# Altium schematic sheet Sheet2.SchDoc
size A3; SheetNumber: 1; SheetTotal: 4
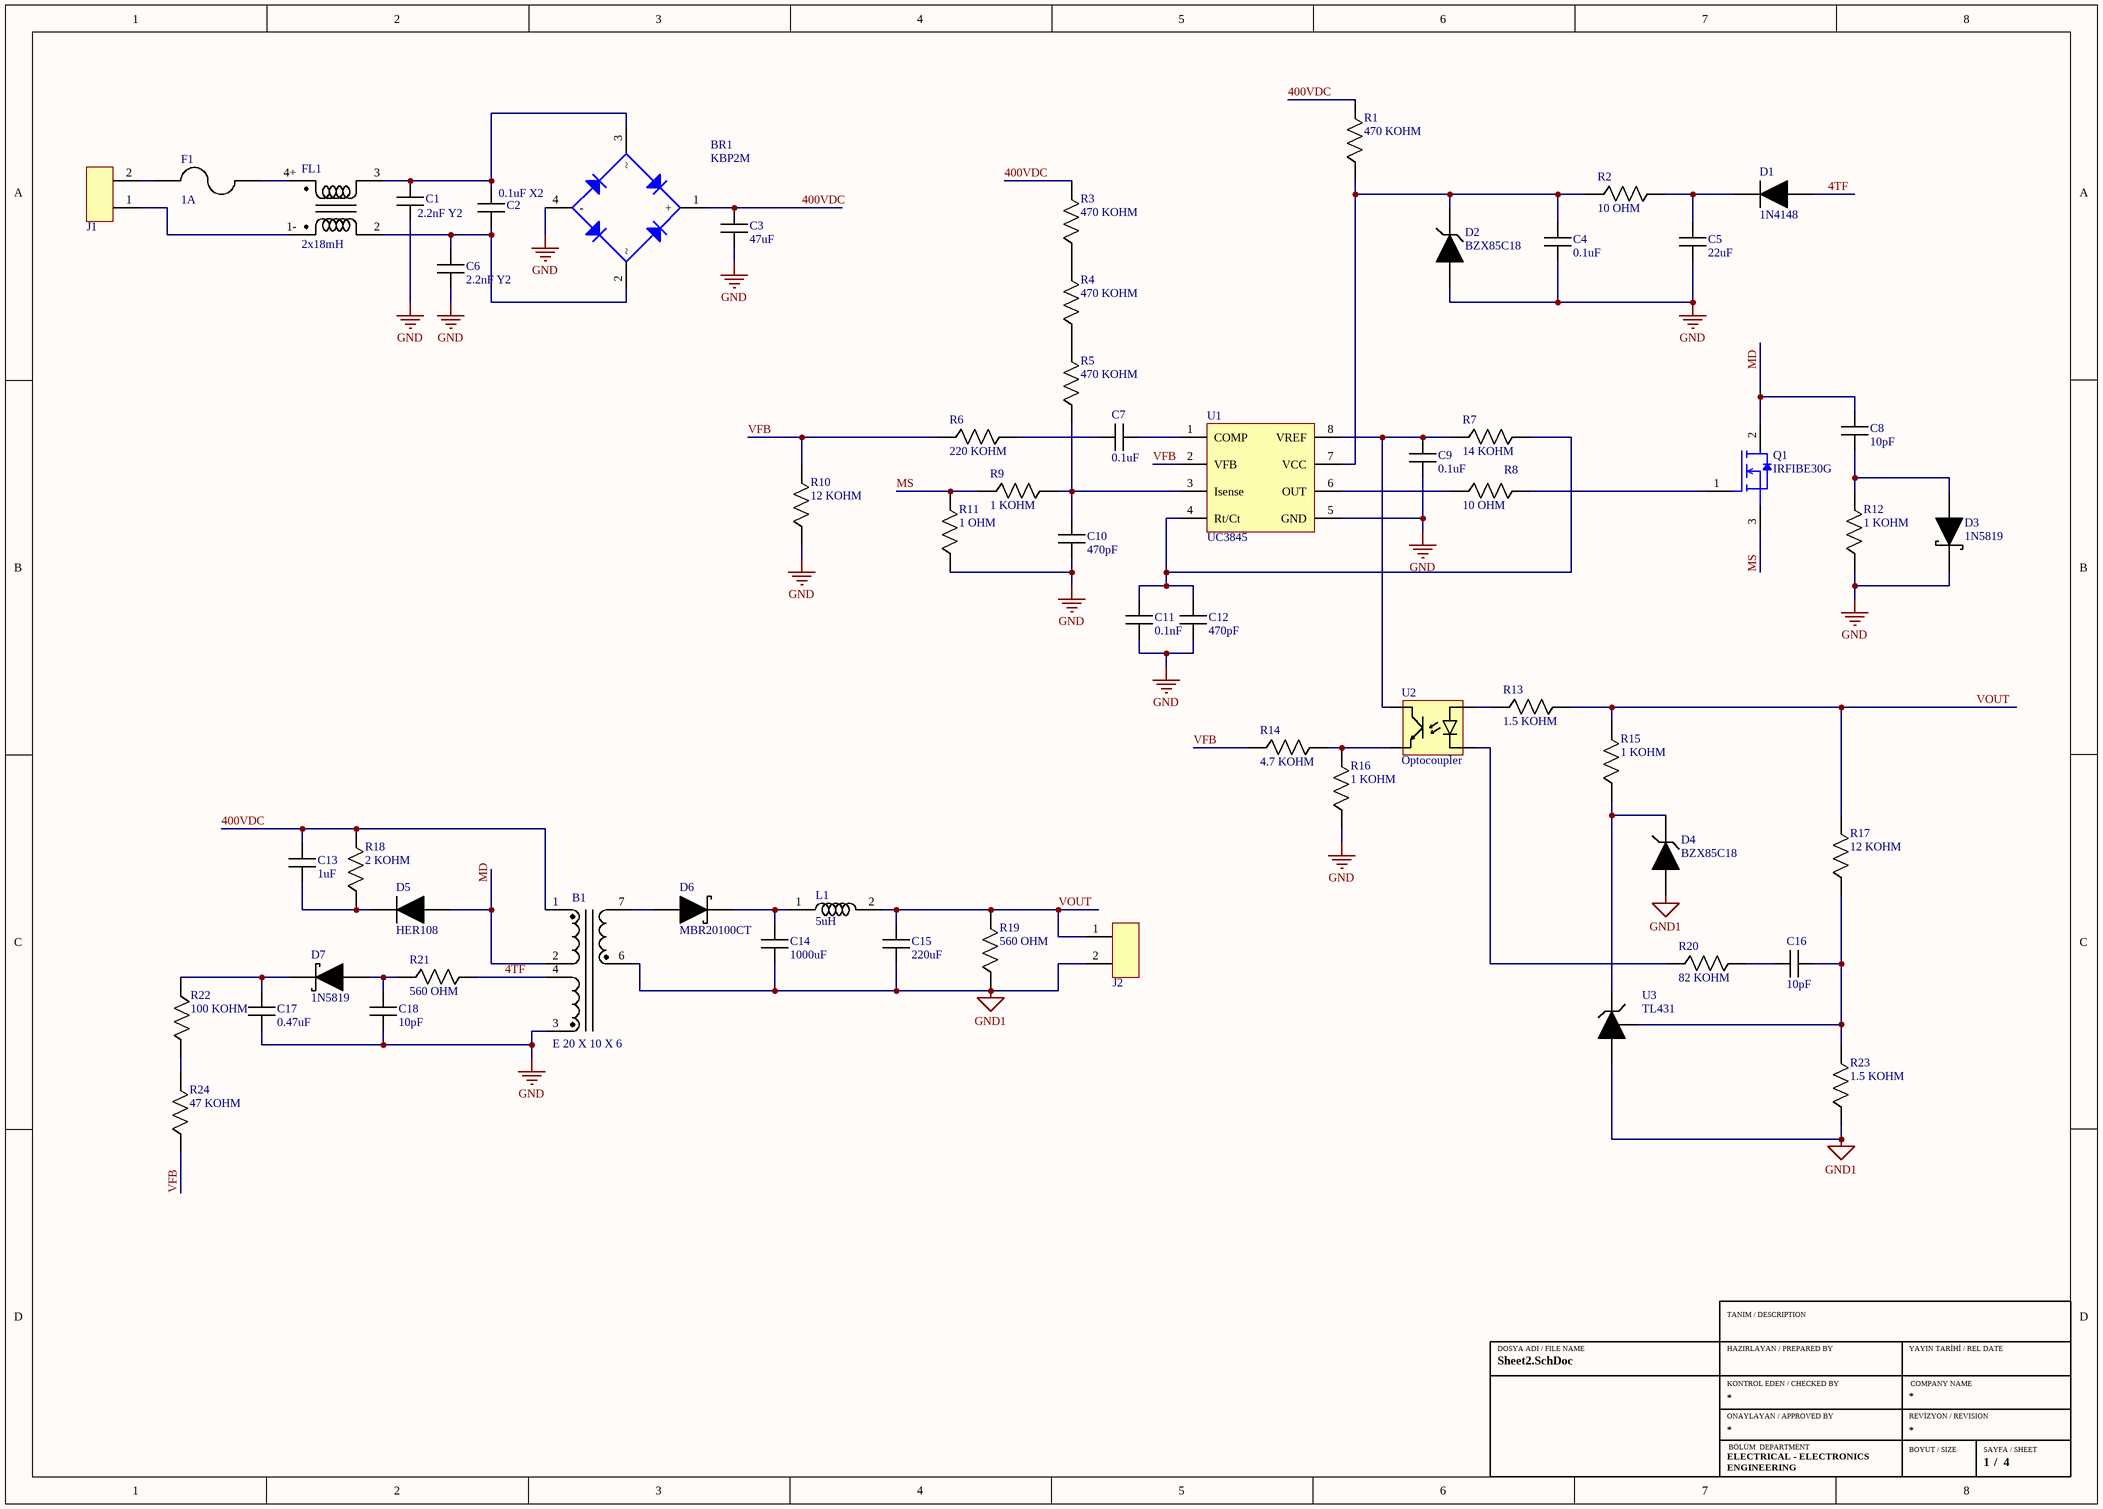
[diagram p0: Sheet2.SchDoc]

## Parts
B1  E 20 X 10 X 6  [BOBBIN]
BR1  KBP2M  [KBP2M]
C1  2.2nF Y2  [Y2-RADIAL]
C2  0.1uF X2  [X2-Radial]
C3  47uF  [CAP ALU 47UF,400VDC]
C4  0.1uF  [CAP CER 100nF]
C5  22uF  [CAP ALU 22uF]
C6  2.2nF Y2  [Y2-RADIAL]
C7  0.1uF  [CAP CER 100nF]
C8  10pF  [CAP ALU 1uF]
C9  0.1uF  [CAP CER 100nF]
C10  470pF  [CAP ALU 1uF]
C11  0.1nF  [CAP CER 100nF]
C12  470pF  [CAP ALU 1uF]
C13  1uF  [CAP ALU 1uF]
C14  1000uF  [CAP ALU 1000uF/16V]
C15  220uF  [CAP ALU 220uF/16v]
C16  10pF  [CAP ALU 1uF]
C17  0.47uF  [CAP ALU 1uF]
C18  10pF  [CAP ALU 1uF]
D1  1N4148  [DO-35]
D2  BZX85C18  [Do-41]
D3  1N5819  [Do-41]
D4  BZX85C18  [Do-41]
D5  HER108  [Do-41]
D6  MBR20100CT  [TO-220]
D7  1N5819  [Do-41]
F1  1A  [fUSE]
FL1  2x18mH  [2x18mH]
J1  HEADER x2  [HEADER X2]  (value not drawn)
J2  HEADER x2  [HEADER X2]  (value not drawn)
L1  5uH  [IND-RADIAL]
Q1  IRFIBE30G  [TO-220]
R1  470 KOHM  [RES]
R2  10 OHM  [RES]
R3  470 KOHM  [RES]
R4  470 KOHM  [RES]
R5  470 KOHM  [RES]
R6  220 KOHM  [RES]
R7  14 KOHM  [RES]
R8  10 OHM  [RES]
R9  1 KOHM  [RES]
R10  12 KOHM  [RES]
R11  1 OHM  [RES]
R12  1 KOHM  [RES]
R13  1.5 KOHM  [RES]
R14  4.7 KOHM  [RES]
R15  1 KOHM  [RES]
R16  1 KOHM  [RES]
R17  12 KOHM  [RES]
R18  2 KOHM  [RES]
R19  560 OHM  [RES]
R20  82 KOHM  [RES]
R21  560 OHM  [RES]
R22  100 KOHM  [RES]
R23  1.5 KOHM  [RES]
R24  47 KOHM  [RES]
U1  UC3845  [8-DIP]
U2  Optocoupler  [4-DIP]
U3  TL431  [TL431 - th - TO92-3]

## Nets
GND: B1.3 BR1.4(-) C1.1 C3.1(-) C4.1(+) C5.1(+) C6.1 C9.1(+) C10.1(+) C11.2(-) C12.2(-) C17.1(+) C18.1(+) D2.A D3.C R10.1 R11.1 R12.1 R16.1 U1.5(GND)
GND1: B1.6 C14.1(+) C15.1(+) D4.A J2.2 R19.1 R23.1 U3.A
4TF: B1.4 D1.A R21.2
400VDC: B1.1 BR1.1(+) C3.2(+) C13.2(-) R1.2 R3.2 R18.2
MD: B1.2 C8.2(-) D5.A Q1.2(D)
MS: Q1.3(S) R9.1 R11.2
VFB: R6.1 R10.2 R14.1 R24.1 U1.2(VFB)
VOUT: C15.2(-) J2.1 L1.2 R13.2 R15.2 R17.2 R19.2
NetB1_7: B1.7 D6.1
NetBR1_2: BR1.2 C2.1 C6.2 FL1.2
NetBR1_3: BR1.3 C1.2 C2.2 FL1.3
NetC4_2: C4.2(-) D2.C R1.1 R2.1 U1.7(VCC)
NetC5_2: C5.2(-) D1.C R2.2
NetC7_1: C7.1(+) R6.2
NetC7_2: C7.2(-) U1.1(COMP)
NetC8_1: C8.1(+) D3.A R12.2
NetC9_2: C9.2(-) R7.1 U1.8(VREF) U2.4
NetC10_2: C10.2(-) R5.1 R9.2 U1.3(Isense)
NetC11_1: C11.1(+) C12.1(+) R7.2 U1.4(Rt/Ct)
NetC13_1: C13.1(+) D5.C R18.1
NetC14_2: C14.2(-) D6.2 L1.1
NetC16_1: C16.1(+) R20.2
NetC16_2: C16.2(-) R17.1 R23.2 U3.R
NetC17_2: C17.2(-) D7.C R22.1
NetC18_2: C18.2(-) D7.A R21.1
NetD4_C: D4.C R15.1 U3.C
NetF1_1: F1.1 J1.2
NetF1_2: F1.2 FL1.4+
NetFL1_1-: FL1.1- J1.1
NetQ1_1: Q1.1(G) R8.2
NetR3_1: R3.1 R4.2
NetR4_1: R4.1 R5.2
NetR8_1: R8.1 U1.6(OUT)
NetR13_1: R13.1 U2.1
NetR14_2: R14.2 R16.2 U2.3
NetR20_1: R20.1 U2.2
NetR22_2: R22.2 R24.2

## Notes on the sheet
- TANIM / DESCRIPTION
- DOSYA ADI / FILE NAME
- HAZIRLAYAN / PREPARED BY
- KONTROL EDEN / CHECKED BY
- YAYIN TARİHİ / REL DATE
- COMPANY NAME
- ONAYLAYAN / APPROVED BY
- ELECTRICAL - ELECTRONICS
- BÖLÜM  DEPARTMENT
- BOYUT / SIZE
- REVİZYON / REVISION
- SAYFA / SHEET
- ENGINEERING
- /

## Library data of the parts
B1 = Transformer: Ferrite Cores & Accessories E20/10/6 N27LP 0.250 MM / B66311G0000X127; Manufacturer: TDK EPCOS; Manufacturer Part Number: B66208-B1110-T1; Supplier 1: Digikey; RoHS: Yes; Stock 1: 6682; Pricing 1: 1=1,27, 10=1,14, 25=0,844, 50=0,802, 100=0,7176, 450=0,63316, 1350=0,58625 (USD); ComponentLink1URL: https://datasheet.ciiva.com/12393/e-25-13-7-525655-12393262.pdf?src-supplier=Mouser; ComponentLink1Description: https://datasheet.ciiva.com/12393/e-25-13-7-525655-12393262.pdf?src-supplier=Mouser; ComponentLink2URL: https://datasheet.ciiva.com/1375/1469926-1375211.pdf?src-supplier=Element14; ComponentLink2Description: https://datasheet.ciiva.com/1375/1469926-1375211.pdf?src-supplier=Element14; Supplier Part Number 1: 495-5372-ND; Supplier 2: Farnell; Category: Uncategorized; Stock 2: 3572; Pricing 2: 1=0,384, 50=0,329, 100=0,274, 250=0,247, 500=0,22, 1470=0,216, 7350=0,215, 14700=0,214 (EUR); ComponentLink3URL: https://datasheet.ciiva.com/22735/1465575-22735656.pdf?src-supplier=Element14; ComponentLink3Description: https://datasheet.ciiva.com/22735/1465575-22735656.pdf?src-supplier=Element14; ComponentLink4URL: https://datasheet.ciiva.com/15162/getdatasheetpartid-476737-15162694.pdf?src-supplier=Verical; ComponentLink4Description: https://datasheet.ciiva.com/15162/getdatasheetpartid-476737-15162694.pdf?src-supplier=Verical; Supplier Part Number 2: 2355087
BR1 = KBP2MI_T0_00101: Bridge Rectifier Single Phase Standard 1 kV Through Hole KBP; Manufacturer: Pan Jit; Supplier 1: DigiKey; Manufacturer Part Number: KBP2MI_T0_00101; RoHS: No; Stock 1: 2737; Pricing 1: 1=0,47, 35=0,37857, 105=0,28124, 525=0,21958, 1015=0,17848, 2030=0,15955, 5005=0,15144, 10010=0,14062, 50015=0,13388 (USD); Supplier Part Number 1: 3757-KBP2MI_T0_00101-ND
C1 C6 = CAP FILM Y2 2200pF/400VAC: CAP FILM 2.2nF 10% 400VAC RADIAL
C2 = Film Cap X2 0.1uF/310VAC: 0.1 µF Film Capacitor 310V Polypropylene (PP), Metallized Radial
C3 = CAP ALU 47uF/400VDC
C4 = CAP CER 0.1uF
C5 = CAP ALU 22uF
C7 C9 = CAP CER 100nF: Cap Ceramic 0.1uF 50V Z5U 20% Radial 5.08mm 85C T/R; Manufacturer: KEMET; Manufacturer Part Number: C322C104M5U5TA7301; Supplier 1: Digikey; RoHS: Yes; Category: Ceramic Capacitors; Stock 1: 1; Pricing 1: 1=0,26, 10=0,166, 50=0,1046, 100=0,0836, 500=0,0604, 1000=0,05343 (USD); ComponentLink1URL: https://datasheet.ciiva.com/39123/f3101-goldmax-39123006.pdf?src-supplier=Onlinecomponents.com; ComponentLink1Description: https://datasheet.ciiva.com/39123/f3101-goldmax-39123006.pdf?src-supplier=Onlinecomponents.com; ComponentLink2URL: https://datasheet.ciiva.com/32430/c052-62-mlcc-series-eng-tds-32430969.pdf?src-supplier=Distrelec; ComponentLink2Description: https://datasheet.ciiva.com/32430/c052-62-mlcc-series-eng-tds-32430969.pdf?src-supplier=Distrelec; ComponentLink3URL: https://datasheet.ciiva.com/6280/f3101-goldmax-6280389.pdf?src-supplier=Digikey; ComponentLink3Description: https://datasheet.ciiva.com/6280/f3101-goldmax-6280389.pdf?src-supplier=Digikey; ComponentLink4URL: https://datasheet.ciiva.com/6280/f3101-goldmax-6280390.pdf?src-supplier=Digikey; ComponentLink4Description: https://datasheet.ciiva.com/6280/f3101-goldmax-6280390.pdf?src-supplier=Digikey; Supplier Part Number 1: 399-9880-1-ND
C8 C16 C18 = CAP CER 10pF
C10 C12 = CAP CER 470pF
C11 = CAP CER 0.1nF
C13 = CAP ALU 1uF/50V: CAP ALUM 1UF 20% 50V RADIAL WCAP-ATG5 Aluminum Electrolytic Capacitors; Manufacturer: Wurth Electronics; Manufacturer Part Number: 860020672005; ESR (Equivalent Series Resistance): 39.553R; Leakage Current: 3uA; Hole Diameter: 800um; Pitch: 2mm; Supplier 1: Digikey; RoHS: Yes; Category: Aluminum Electrolytic Capacitors; Stock 1: 34223; Pricing 1: 1=0,1, 50=0,089, 100=0,078, 250=0,069, 500=0,06, 1000=0,058 (USD); Length: 11mm; ComponentLink1URL: http://www.farnell.com/datasheets/1879647.pdf?src-supplier=Farnell; ComponentLink1Description: http://www.farnell.com/datasheets/1879647.pdf?src-supplier=Farnell; ComponentLink2URL: http://www.farnell.com/datasheets/1879647.pdf?src-supplier=Element14; ComponentLink2Description: http://www.farnell.com/datasheets/1879647.pdf?src-supplier=Element14; ComponentLink3URL: http://katalog.we-online.de/pbs/datasheet/860020672005.pdf?src-supplier=Digikey; ComponentLink3Description: http://katalog.we-online.de/pbs/datasheet/860020672005.pdf?src-supplier=Digikey; ComponentLink4URL: https://katalog.we-online.de/pbs/datasheet/860020672005.pdf?src-supplier=Digikey; ComponentLink4Description: https://katalog.we-online.de/pbs/datasheet/860020672005.pdf?src-supplier=Digikey; Supplier Part Number 1: 732-8851-1-ND
C14 = CAP ALU 1000uF: Cap Aluminum Lytic 1000uF 16V 20% (10 X 16mm) Radial 5mm 1760mA 10000h 105C Bulk; Manufacturer: Rubycon; Manufacturer Part Number: 16ZLH1000MEFC10X16; Supplier 1: Digikey; RoHS: Yes; Category: Aluminum Electrolytic Capacitors; Stock 1: 8548; Pricing 1: 1=0,62, 10=0,389, 50=0,2868, 100=0,2543, 500=0,19906, 1000=0,18203, 3000=0,16421, 5000=0,1536 (USD); ComponentLink1URL: https://datasheet.ciiva.com/16313/e-zlh-16313390.pdf?src-supplier=Future+Electronics; ComponentLink1Description: https://datasheet.ciiva.com/16313/e-zlh-16313390.pdf?src-supplier=Future+Electronics; ComponentLink2URL: https://datasheet.ciiva.com/22732/1910927-22732477.pdf?src-supplier=Element14; ComponentLink2Description: https://datasheet.ciiva.com/22732/1910927-22732477.pdf?src-supplier=Element14; ComponentLink3URL: https://datasheet.ciiva.com/6300/e-zlh-6300460.pdf?src-supplier=Digikey; ComponentLink3Description: https://datasheet.ciiva.com/6300/e-zlh-6300460.pdf?src-supplier=Digikey; ComponentLink4URL: https://datasheet.ciiva.com/11692/e-zlh-11692166.pdf?src-supplier=Avnet; ComponentLink4Description: https://datasheet.ciiva.com/11692/e-zlh-11692166.pdf?src-supplier=Avnet; Supplier Part Number 1: 1189-1147-ND
C15 = CAP ALU 220uF: Aluminum Electrolytic Capacitor, 220uF 16 V, BT Series 5000h 10 x 12.5mm; Manufacturer: Nichicon; Manufacturer Part Number: UBT1C221MPD8; Supplier 1: Digikey; RoHS: Yes; Category: Aluminum Electrolytic Capacitors; Stock 1: 1881; Pricing 1: 1=0,8, 10=0,56, 50=0,4718, 100=0,3841, 500=0,32008, 2000=0,2527, 4000=0,23586 (USD); ComponentLink1URL: https://datasheet.ciiva.com/25613/0900766b810dc68a-25613514.pdf?src-supplier=Rs; ComponentLink1Description: https://datasheet.ciiva.com/25613/0900766b810dc68a-25613514.pdf?src-supplier=Rs; Supplier Part Number 1: 493-UBT1C221MPD8-ND
C17 = CAP ALU 0.47uF
D1 = DIODE 1N4148: 1N4148 Series 500 mW 100 V Max Reverse Voltage 200 mA Small Signal Diode -DO-35; Manufacturer: ON Semiconductor / Fairchild; Polarity: 4901Direction; Capacitance: 4pF; Current Rating: 200mA; Voltage Rating (DC): 100V; Forward Current: 300mA; Current: 4A; Reverse Recovery Time: 4ns; Max Reverse Current: 5uA; Supplier 1: Digikey; Manufacturer Part Number: 1N4148; RoHS: Yes; Category: Rectifier Diodes; Stock 1: 222319; Pricing 1: 1=0,1, 10=0,057, 100=0,0306, 500=0,024, 1000=0,01666, 2000=0,01381, 5000=0,01305, 10000=0,01111, 50000=0,00889 (USD); Mount: Through Hole; Case/Package: DO-35; Number of Pins: 2; Min Operating Temperature: -65°C; Max Operating Temperature: 175°C; Packaging: Bulk; Output Current: 200mA; Max Repetitive Reverse Voltage (Vrrm): 100V; Voltage: 100V; Peak Non-Repetitive Surge Current: 4A; Diameter: 1.91mm; Length: 4.56mm; Width: 1.91mm; Height: 1.91mm; Lead Free: 5697LeadFree; RoHS Compliant: Yes; ComponentLink1URL: https://datasheet.ciiva.com/27049/743285-27049708.pdf?src-supplier=Jameco; ComponentLink1Description: https://datasheet.ciiva.com/27049/743285-27049708.pdf?src-supplier=Jameco; ComponentLink2URL: https://datasheet.ciiva.com/1242/1716967-1242233.pdf?src-supplier=Newark; ComponentLink2Description: https://datasheet.ciiva.com/1242/1716967-1242233.pdf?src-supplier=Newark; ComponentLink3URL: https://datasheet.ciiva.com/910/1n914-910546.pdf?src-supplier=Digikey; ComponentLink3Description: https://datasheet.ciiva.com/910/1n914-910546.pdf?src-supplier=Digikey; ComponentLink4URL: https://datasheet.ciiva.com/3304/fdll914b-3304217.pdf?src-supplier=Avnet; ComponentLink4Description: https://datasheet.ciiva.com/3304/fdll914b-3304217.pdf?src-supplier=Avnet; ComponentLink5URL: https://datasheet.ciiva.com/25951/fdll914b-25951516.pdf?; ComponentLink5Description: https://datasheet.ciiva.com/25951/fdll914b-25951516.pdf?; Supplier Part Number 1: 1N4148FS-ND
D2 D4 = BZX85C18: BZX85C Series 1 W 18 V 200 mA Through Hole Zener Diode - DO-41; Manufacturer: ON Semiconductor / Fairchild; Supplier 1: Avnet; Manufacturer Part Number: BZX85C18; RoHS: Yes; Category: Zener Diodes; Stock 1: 196750; Pricing 1: 25000=0,0296, 26000=0,0288, 51000=0,028, 130000=0,0272, 250000=0,0264, 1300000=0,0256, 2500000=0,0248 (USD); ComponentLink1URL: https://datasheet.ciiva.com/25623/0900766b810c0855-25623848.pdf?src-supplier=Rs; ComponentLink1Description: https://datasheet.ciiva.com/25623/0900766b810c0855-25623848.pdf?src-supplier=Rs; ComponentLink2URL: https://datasheet.ciiva.com/15142/getdatasheetpartid-60279-15142246.pdf?src-supplier=Verical; ComponentLink2Description: https://datasheet.ciiva.com/15142/getdatasheetpartid-60279-15142246.pdf?src-supplier=Verical; ComponentLink3URL: https://datasheet.ciiva.com/8059/1751942-8059591.pdf?src-supplier=Element14; ComponentLink3Description: https://datasheet.ciiva.com/8059/1751942-8059591.pdf?src-supplier=Element14; ComponentLink4URL: https://datasheet.ciiva.com/8347/bzx85c9v1-8347335.pdf?src-supplier=Avnet; ComponentLink4Description: https://datasheet.ciiva.com/8347/bzx85c9v1-8347335.pdf?src-supplier=Avnet; Supplier Part Number 1: BZX85C18
D3 D7 = 1N5819: Rectifier Diode, Schottky, 1 Phase, 1 Element, 1A, 40V V(RRM), Silicon, DO-41; Manufacturer: STMicroelectronics; Supplier 1: Digikey; Manufacturer Part Number: 1N5819; RoHS: Yes; Category: Rectifier Diodes; Stock 1: 24000; Pricing 1: 2000=0,0684, 6000=0,0654, 10000=0,05656, 50000=0,04596, 200000=0,04525 (USD); ComponentLink1URL: https://datasheet.ciiva.com/26338/155460-da-01-en-diode-1n5819-stm-26338798.pdf?src-supplier=Conrad; ComponentLink1Description: https://datasheet.ciiva.com/26338/155460-da-01-en-diode-1n5819-stm-26338798.pdf?src-supplier=Conrad; ComponentLink2URL: https://datasheet.ciiva.com/16303/cd00001625-16303290.pdf?src-supplier=Future+Electronics; ComponentLink2Description: https://datasheet.ciiva.com/16303/cd00001625-16303290.pdf?src-supplier=Future+Electronics; ComponentLink3URL: https://datasheet.ciiva.com/14557/70013816-14557645.pdf?src-supplier=Allied+Electronics; ComponentLink3Description: https://datasheet.ciiva.com/14557/70013816-14557645.pdf?src-supplier=Allied+Electronics; ComponentLink4URL: https://datasheet.ciiva.com/1177/1449529-1177085.pdf?src-supplier=Element14; ComponentLink4Description: https://datasheet.ciiva.com/1177/1449529-1177085.pdf?src-supplier=Element14; ComponentLink5URL: https://datasheet.ciiva.com/915/cd00001625-915555.pdf?src-supplier=Digikey; ComponentLink5Description: https://datasheet.ciiva.com/915/cd00001625-915555.pdf?src-supplier=Digikey; ComponentLink6URL: https://datasheet.ciiva.com/915/cd00001625-915556.pdf?src-supplier=Digikey; ComponentLink6Description: https://datasheet.ciiva.com/915/cd00001625-915556.pdf?src-supplier=Digikey; Supplier Part Number 1: 497-6610-3-ND
D5 = Diode 1000V-1A: 75ns, 1A, 1000V, High Efficient Recovery Rectifier; Manufacturer: Taiwan Semiconductor; Manufacturer Part Number: HER108G A0G; Max Reverse Voltage (DC): 1kV; Supplier 1: Digikey; RoHS: Yes; Stock 1: 4964; Pricing 1: 1=0,49, 10=0,34, 100=0,1719, 500=0,14026, 1000=0,10407 (USD); Mount: Through Hole; Series: -; Packaging: Tape and Reel; Average Rectified Current: 1A; Reverse Recovery Time: 75ns; RoHS Compliant: Yes; Supplier Part Number 1: HER108GA0GCT-ND
D6 = MBR20100CT: Dual Common-Cathode High-Voltage Schottky Rectifier | DIODE ARRAY SCHOTTKY 100V TO220; Manufacturer: Vishay Semiconductors; Manufacturer Part Number: MBR20100CT-E3/4W; Supplier 1: Digikey; RoHS: Yes; Category: Rectifier Diodes; Stock 1: 3630; Pricing 1: 1=1,98, 50=1,5872, 100=1,306, 500=1,10506, 1000=0,93762, 2000=0,89074, 5000=0,85726, 10000=0,82888 (USD); Reverse Voltage: 100V; ComponentLink1URL: https://datasheet.ciiva.com/16446/mbrb2080-16446902.pdf?src-supplier=Future+Electronics; ComponentLink1Description: https://datasheet.ciiva.com/16446/mbrb2080-16446902.pdf?src-supplier=Future+Electronics; Supplier Part Number 1: MBR20100CT-E3/4WGI-ND
F1 = Fuse: 1A FUSE
FL1 = EMI Filter: 2x18mH choke
L1 = IND RADIAL 5uH: Fixed Ind 5UH 20A 5 Mohm Th; Manufacturer: Hammond Manufacturing; Manufacturer Part Number: 1539M10; Supplier 1: Digikey; RoHS: No; Category: Fixed Inductors; Stock 1: 8; Pricing 1: 1=15,7, 10=14,911 (USD); ComponentLink1URL: http://www.mouser.com/ds/2/177/5c0038-44785.pdf?src-supplier=Mouser; ComponentLink1Description: http://www.mouser.com/ds/2/177/5c0038-44785.pdf?src-supplier=Mouser; ComponentLink2URL: http://www.hammondmfg.com/pdf/5c0038.pdf?src-supplier=Digikey; ComponentLink2Description: http://www.hammondmfg.com/pdf/5c0038.pdf?src-supplier=Digikey; Supplier Part Number 1: HM3375-ND
Q1 = IRFIBE30G: Single N-Channel 800 V 3 Ohms Flange Mount Power Mosfet - TO-220FP; Manufacturer: Vishay; Manufacturer Part Number: IRFIBE30GPBF; Supplier 1: Digikey; RoHS: Yes; Category: MOSFETs; Stock 1: 1845; Pricing 1: 1=2,71, 50=2,1504, 100=1,8433, 500=1,63846, 1000=1,40293, 2000=1,32101, 5000=1,26738 (USD); ComponentLink1URL: https://datasheet.ciiva.com/8025/irfibe30gpbf-8025460.pdf?src-supplier=Element14; ComponentLink1Description: https://datasheet.ciiva.com/8025/irfibe30gpbf-8025460.pdf?src-supplier=Element14; ComponentLink2URL: https://datasheet.ciiva.com/16226/91184-16226618.pdf?src-supplier=Future+Electronics; ComponentLink2Description: https://datasheet.ciiva.com/16226/91184-16226618.pdf?src-supplier=Future+Electronics; Supplier Part Number 1: IRFIBE30GPBF-ND
R1 R3-R5 = RES 470 KOHM
R2 R8 = RES 10 OHM
R6 = RES 220 KOHM
R7 = RES 14 KOHM
R9 R12 R15 R16 = RES 1 KOHM
R10 R17 = RES 12 KOHM
R11 = RES 1 OHM
R13 R23 = RES 1.5 KOHM
R14 = RES 4.7 KOHM
R18 = RES 2 KOHM
R19 R21 = RES 560 OHM
R20 = RES 82 KOHM
R22 = RES 100 KOHM
R24 = RES 47 KOHM
U1 = UC3845: Boost, Flyback Regulator Positive, Isolation Capable Output Step-Up/Step-Down  DC-DC Controller IC 8-Mini DIP; Manufacturer: STMicroelectronics; Manufacturer Part Number: UC3845BN; Supplier 1: Digikey; RoHS: Yes; Category: Voltage Regulators - Switching; Stock 1: 2211; Pricing 1: 1=0,99, 10=0,889, 50=0,8438, 100=0,6932, 250=0,64796, 500=0,57262, 1000=0,45208, 2500=0,42194, 5000=0,40084 (USD); ComponentLink1URL: https://datasheet.ciiva.com/15108/getdatasheetpartid-31655-15108079.pdf?src-supplier=Verical; ComponentLink1Description: https://datasheet.ciiva.com/15108/getdatasheetpartid-31655-15108079.pdf?src-supplier=Verical; ComponentLink2URL: https://datasheet.ciiva.com/16394/cd00000966-16394470.pdf?src-supplier=Future+Electronics; ComponentLink2Description: https://datasheet.ciiva.com/16394/cd00000966-16394470.pdf?src-supplier=Future+Electronics; ComponentLink3URL: https://datasheet.ciiva.com/4875/cd00000966-4875756.pdf?src-supplier=Mouser; ComponentLink3Description: https://datasheet.ciiva.com/4875/cd00000966-4875756.pdf?src-supplier=Mouser; ComponentLink4URL: https://datasheet.ciiva.com/45260/cd00000966-45260200.pdf?src-supplier=Digikey; ComponentLink4Description: https://datasheet.ciiva.com/45260/cd00000966-45260200.pdf?src-supplier=Digikey; ComponentLink5URL: https://datasheet.ciiva.com/1513/1696818-1513208.pdf?src-supplier=Element14; ComponentLink5Description: https://datasheet.ciiva.com/1513/1696818-1513208.pdf?src-supplier=Element14; Supplier Part Number 1: 497-14808-5-ND
U2 = Optocoupler: Optocoupler DC-IN 1-CH Darlington DC-OUT 4-Pin PDIP Magazine; Manufacturer: Renesas; Manufacturer Part Number: PS2502-1-A; Supplier 1: Digikey; RoHS: Yes; Category: Optocouplers; Stock 1: 9709; Pricing 1: 1=0,73, 10=0,462, 100=0,3415, 500=0,325 (USD); ComponentLink1URL: https://datasheet.ciiva.com/9218/pn10226ej04v0ds-9218496.pdf?src-supplier=Avnet; ComponentLink1Description: https://datasheet.ciiva.com/9218/pn10226ej04v0ds-9218496.pdf?src-supplier=Avnet; Supplier Part Number 1: 559-1009-ND
U3 = TL431 - th: Shunt Voltage Reference IC Adjustable 2.495V 36 VV ±1% 100 mA TO-92-3; Manufacturer: Texas Instruments; Manufacturer Part Number: TL431ACLPR; Supplier 1: Digikey; RoHS: Yes; Category: Voltage References; Stock 1: 10278; Pricing 1: 1=0,39, 10=0,289, 25=0,2532, 100=0,1639, 250=0,13568, 500=0,10854, 1000=0,08321 (USD); ComponentLink1URL: https://datasheet.ciiva.com/15149/getdatasheetpartid-238763-15149135.pdf?src-supplier=Verical; ComponentLink1Description: https://datasheet.ciiva.com/15149/getdatasheetpartid-238763-15149135.pdf?src-supplier=Verical; ComponentLink2URL: https://datasheet.ciiva.com/41462/001014545-da-01-en-ic-vref-shunt-pre-tl431aclpr-to-92-3-tid-41462399.pdf?src-supplier=Conrad; ComponentLink2Description: https://datasheet.ciiva.com/41462/001014545-da-01-en-ic-vref-shunt-pre-tl431aclpr-to-92-3-tid-41462399.pdf?src-supplier=Conrad; ComponentLink3URL: https://datasheet.ciiva.com/3235/tl432b-3235595.pdf?src-supplier=Avnet; ComponentLink3Description: https://datasheet.ciiva.com/3235/tl432b-3235595.pdf?src-supplier=Avnet; ComponentLink4URL: https://datasheet.ciiva.com/3236/tl432b-3236342.pdf?src-supplier=Avnet; ComponentLink4Description: https://datasheet.ciiva.com/3236/tl432b-3236342.pdf?src-supplier=Avnet; ComponentLink5URL: https://datasheet.ciiva.com/2006/tl431a-2006226.pdf?src-supplier=Digikey; ComponentLink5Description: https://datasheet.ciiva.com/2006/tl431a-2006226.pdf?src-supplier=Digikey; ComponentLink6URL: https://datasheet.ciiva.com/2006/tl431a-2006227.pdf?src-supplier=Digikey; ComponentLink6Description: https://datasheet.ciiva.com/2006/tl431a-2006227.pdf?src-supplier=Digikey; ComponentLink7URL: https://datasheet.ciiva.com/2006/tl431a-2006228.pdf?src-supplier=Digikey; ComponentLink7Description: https://datasheet.ciiva.com/2006/tl431a-2006228.pdf?src-supplier=Digikey; ComponentLink8URL: https://datasheet.ciiva.com/46397/1887475-46397717.pdf?src-supplier=Element14; ComponentLink8Description: https://datasheet.ciiva.com/46397/1887475-46397717.pdf?src-supplier=Element14; Supplier Part Number 1: 296-TL431ACLPRCT-ND